# Altium schematic sheet Sheet1chinh_thuc_2.SchDoc
size A4; SheetNumber: 1; SheetTotal: 1
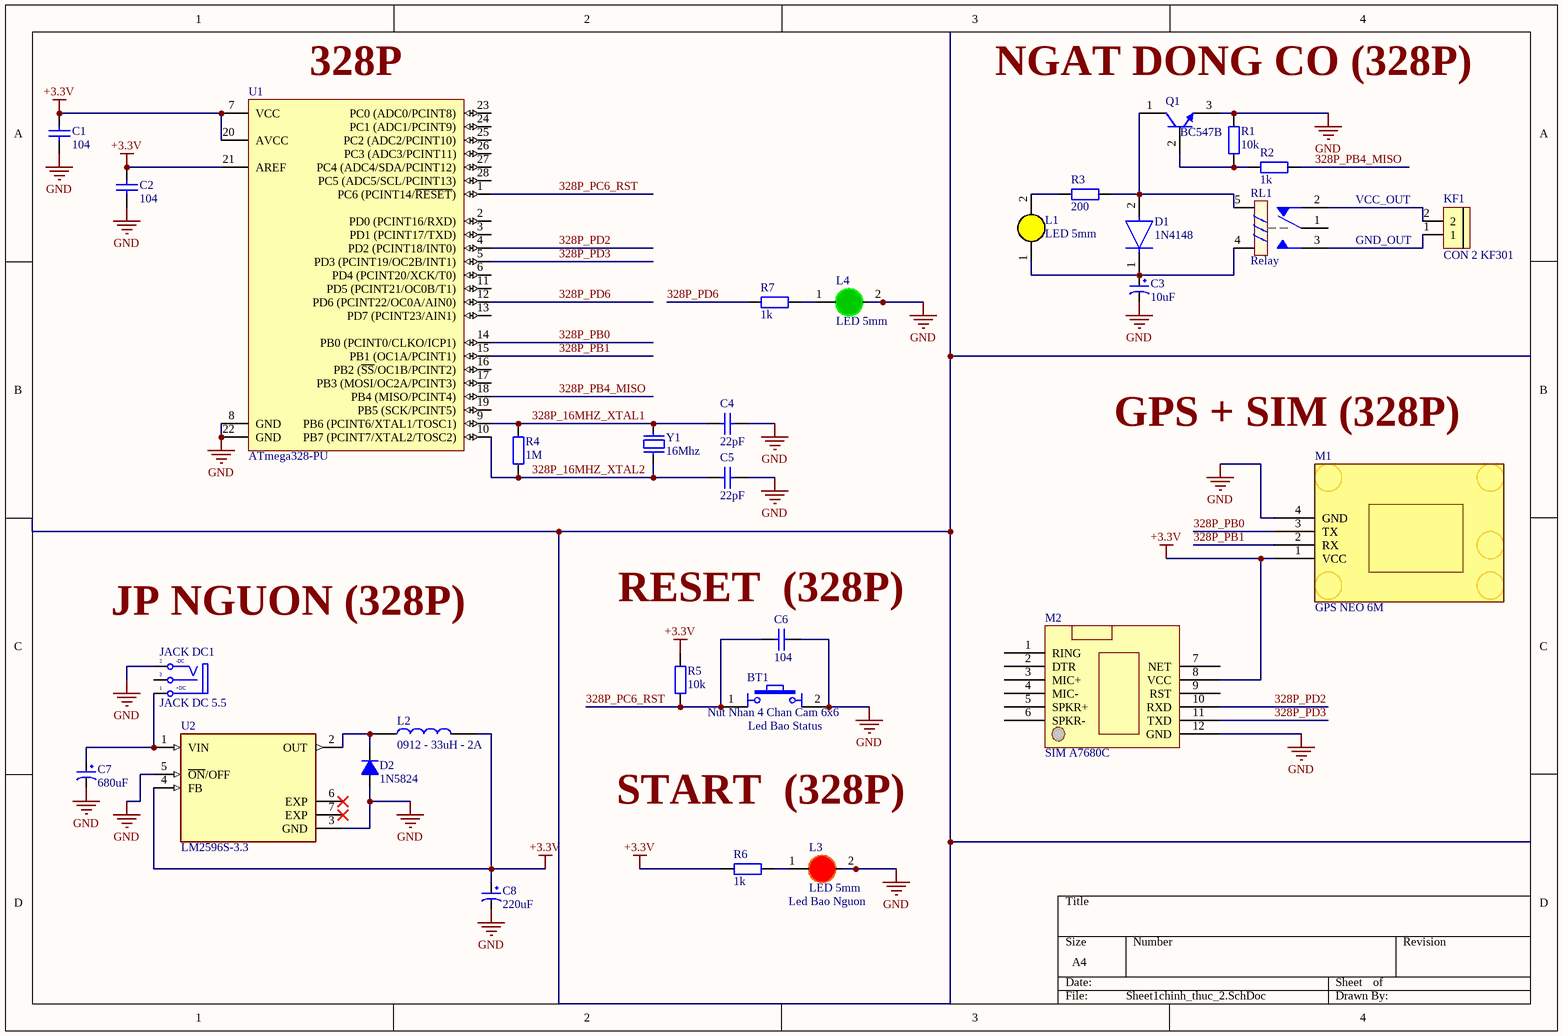
[diagram p0: Sheet1chinh_thuc_2.SchDoc]

## Parts
BT1  Nut Nhan 4 Chan Cam 6x6  [Nut Nhan 4 Chan Cam 6x6]
C1  104  [tu gom]
C2  104  [tu gom]
C3  10uF  [tu hoa 4mm]
C4  22pF  [tu gom]
C5  22pF  [tu gom]
C6  104  [tu gom]
C7  680uF  [tu hoa 13mm]
C8  220uF  [Tu hoa 8mm]
D1  1N4148  [FP-017AG-MFG]
D2  1N5824  [DIODE 0.5A]
JACK_DC1  JACK DC 5.5  [JACK DC 5.5]
KF1  CON 2 KF301  [Con 2 KF301 5.08]
L1  LED 5mm  [LED-5MM-Yellow]
L2  0912 - 33uH - 2A  [CUON CAM 100uH3A]
L3  LED 5mm  [LED-5MM-RED]
L4  LED 5mm  [LED-5MM-Green]
M1  GPS NEO 6M  [PCBComponent_1]
M2  SIM A7680C  [PCBComponent_1]
Q1  BC547B  [ONSC-TO-92-3-29-11]
R1  10k  [tro vach 1/2w]
R2  1k  [tro vach 1/2w]
R3  200  [tro vach 1/2w]
R4  1M  [tro vach 1/2w]
R5  10k  [tro vach 1/2w]
R6  1k  [tro vach 1/2w]
R7  1k  [tro vach 1/2w]
RL1  Relay  [Relay 5 Chan SRD]
U1  ATmega328-PU  [28P3]
U2  LM2596S-3.3  [VREG_LM2596S-3.3]
Y1  16Mhz  [Thach Anh 2 chan cam]

## Nets
+3.3V: C1.1 C2.1 C8.1 L2.2 M1.1(VCC) M2.8(VCC) R5.2 R6.1 U1.7(VCC) U1.20(AVCC) U1.21(AREF) U2.4(FB)
GND: BT1.2 C1.2 C2.2 C3.2 C4.1 C5.1 C6.1 C7.2 C8.2 D2.1(A) JACK_DC1.2(TN) L3.2(K) L4.2(K) M1.4(GND) M2.12(GND) Q1.3(E) R1.2 U1.8(GND) U1.22(GND) U2.3(GND) U2.5(~{ON}/OFF)
328P_16MHZ_XTAL1: C4.2 R4.2 U1.9(PB6_(PCINT6/XTAL1/TOSC1)) Y1.2
328P_16MHZ_XTAL2: C5.2 R4.1 U1.10(PB7_(PCINT7/XTAL2/TOSC2)) Y1.1
328P_PB0: M1.3(TX) U1.14(PB0_(PCINT0/CLKO/ICP1))
328P_PB1: M1.2(RX) U1.15(PB1_(OC1A/PCINT1))
328P_PB4_MISO: R2.2 U1.18(PB4_(MISO/PCINT4))
328P_PC6_RST: BT1.1 C6.2 R5.1 U1.1(PC6_(PCINT14/~{RESET}))
328P_PD2: M2.10(RXD) U1.4(PD2_(PCINT18/INT0))
328P_PD3: M2.11(TXD) U1.5(PD3_(PCINT19/OC2B/INT1))
328P_PD6: R7.1 U1.12(PD6_(PCINT22/OC0A/AIN0))
NetC3_1: C3.1 D1.1(C) L1.1(A) RL1.4
NetC7_1: C7.1 JACK_DC1.1(T) U2.1(VIN)
NetD1_2: D1.2(A) Q1.1(C) R3.2 RL1.5
NetD2_2: D2.2(K) L2.1 U2.2(OUT)
NetKF1_1: KF1.1 RL1.3
NetKF1_2: KF1.2 RL1.2
NetL1_2: L1.2(K) R3.1
NetL3_1: L3.1(A) R6.2
NetL4_1: L4.1(A) R7.2
NetQ1_2: Q1.2(B) R1.1 R2.1

Not connected (* = marked no-connect by the designer): JACK_DC1 3(S); M2 1(RING) 2(DTR) 3(MIC+) 4(MIC-) 5(SPKR+) 6(SPKR-) 7(NET) 9(RST); RL1 1; U1 2(PD0_(PCINT16/RXD)) 3(PD1_(PCINT17/TXD)) 6(PD4_(PCINT20/XCK/T0)) 11(PD5_(PCINT21/OC0B/T1)) 13(PD7_(PCINT23/AIN1)) 16(PB2_(~{SS}/OC1B/PCINT2)) 17(PB3_(MOSI/OC2A/PCINT3)) 19(PB5_(SCK/PCINT5)) 23(PC0_(ADC0/PCINT8)) 24(PC1_(ADC1/PCINT9)) 25(PC2_(ADC2/PCINT10)) 26(PC3_(ADC3/PCINT11)) 27(PC4_(ADC4/SDA/PCINT12)) 28(PC5_(ADC5/SCL/PCINT13)); U2 6(EXP)* 7(EXP)*

## Notes on the sheet
- (near U1) 328P
- NGAT DONG CO (328P)
- VCC_OUT
- GND_OUT
- GPS + SIM (328P)
- (near JACK_DC1) JP NGUON (328P)
- (near C6) RESET  (328P)
- (near BT1) Led Bao Status
- START  (328P)
- Led Bao Nguon
- (in symbol JACK DC 5.5) -DC; +DC

## Library data of the parts
BT1 = Nut Nhan 4 Chan Cam 6x6: Nut Nhan 4 Chan 6x6mm; Ten: Nút Nhấn 4 Chân 6x6x5MM DIP; Ma_Hang: MH004584
C1 C2 C6 = Tu gom 104 50V: Cắm; So_Chan: 2; Ten_Linh_Kien: Tụ gốm 104 100nF 50V; Don_Vi: Con; Ma_Hang: MH004761; Chung_Loai: Cắm; Kieu_Chan: *
C3 = Tu Hoa 10uF 25V 4x7: Cắm; So_Chan: 2; Ten_Linh_Kien: Tụ Hóa 10uF 25V 4x7MM; Don_Vi: Con; Ma_Hang: MH001349; Chung_Loai: Cắm; Kieu_Chan: *
C4 C5 = Tu gom 22pF 50V: Cắm; Don_Vi: Con; So_Chan: 2; Ten_Linh_Kien: Tụ gốm 22P 50V; Ma_Hang: MH004771; Chung_Loai: Cắm; Kieu_Chan: *
C7 = Tu Hoa 680uF 25V 13x17: Cắm; Don_Vi: Con; So_Chan: 2; Ten_Linh_Kien: Tụ Hóa 680uF 25V; Ma_Hang: MH005082; Chung_Loai: Cắm; Kieu_Chan: *
C8 = Tu Hoa 220uF 25V 8x10: Cắm; Don_Vi: Con; So_Chan: 2; Ten_Linh_Kien: Tụ Hóa 220uF 25V 8x10MM; Ma_Hang: MH006864; Chung_Loai: Cắm; Kieu_Chan: *
D1 = CMP-07163-000046-1: DIODE GEN PURP 100V 200MA DO35; Forward Voltage: 1V; Max Power Dissipation: 500mW; Max Reverse Current: 5uA; Forward Current: 300mA; Current: 4A; Reverse Recovery Time: 4ns; Element Configuration: Single; Outside Diameter: 1.85mm; Capacitance: 4pF; Polarity: Standard; Max Forward Surge Current (Ifsm): 1A; Reverse Voltage: 100V; Output Current: 200mA; Average Rectified Current: 200mA; Diameter: 1.91mm; Max Repetitive Reverse Voltage (Vrrm): 100V; Current Rating: 200mA; Case/Package: DO-35; Lead Free: Lead Free; Number of Pins: 2; Recovery Time: 4ns; Packaging: Bulk; Contact Plating: Tin; Voltage: 100V; Mount: Through Hole; Max Surge Current: 4A; Package Quantity: 2000; Width: 1.91mm; Max Reverse Voltage (DC): 100V; Length: 4.56mm; Radiation Hardening: No; Power Dissipation: 500mW; Voltage Rating (DC): 100V; Peak Non-Repetitive Surge Current: 4A; REACH SVHC: No SVHC; Height: 4.56mm; Max Operating Temperature: 175°C; Series: -; Weight: 0.01lb; Min Operating Temperature: -65°C
D2 = Diode 1N4148: Cắm; Ten_Linh_Kien: Diode 1N4148 DO35 450mA 100V ( 1N4148 DIP); Don_Vi: Con; Ma_Hang: MH001065; Ghi Chu: *; Kieu_Chan: *; Chung_Loai: Cắm
JACK_DC1 = JACK DC 5.5: Value: Jac DC
KF1 = CON 2 KF301: Cắm; Ma_Hang: MH000987; Ten_Linh_Kien: CON 2 KF301-2P 5.08MM Xanh Dương; Chung_Loai: Cắm; Ghi_Chu: *; Kieu_Chan: *; Don_Vi: Con
L1 = LED 5mm Vang: Cắm; Don_Vi: Con; Ma_Hang: MH008968; Ten_Linh_Kien: Led 5MM Phủ Vàng (1000c); Ghi_Chu: *; Kieu_Chan: *; Chung_Loai: Cắm
L2 = CUON CAM 470uH DIP: Cắm; Don_Vi: Con; Ma_Hang: MH002232; Ten_Linh_Kien: Cuộn Cảm 470uH 3A 8x10MM; Ghi_Chu: *; Kieu_Chan: *; Chung_Loai: Cắm
L3 = LED 5mm Do: Cắm; Don_Vi: Con; Ma_Hang: MH008967; Ten_Linh_Kien: Led 5MM Phủ Đỏ (1000c); Ghi_Chu: *; Kieu_Chan: *; Chung_Loai: Cắm
L4 = LED 5mm Xanh La: Cắm; Don_Vi: Con; Ma_Hang: MH008969; Ten_Linh_Kien: LED 5MM Phủ Xanh (1000c); Ghi_Chu: *; Kieu_Chan: *; Chung_Loai: Cắm
Q1 = CMP-1048-01467-1: Amplifier Transistor, NPN Silicon, 3-Pin TO-92, Bulk Box; Manufacturer: On Semiconductor; IC Continuous (A): 0.1; fT Min (MHz): 150; DatasheetVersion: Rev. 7; ComponentLink1URL: http://www.onsemi.com/; Polarity: NPN; RoHS: FALSE; ComponentLink1Description: Manufacturer URL; Packing: Bulk Box; PackageDescription: 3-Pin Transistor Outline, Body 4.825 x 3.685 mm, Pitch 1.27 mm; ComponentLink3URL: http://www.onsemi.cn/pub_link/Collateral/2N6426-D.PDF; ComponentLink2Description: Datasheet; PackageVersion: Rev. AM; PackageReference: TO-92-3-29-11_AM_SL; ComponentLink3Description: Package Specification; Mounting Technology: Through Hole; PartNumber: BC547B; ComponentLink2URL: http://www.onsemi.com/pub_link/Collateral/BC546-D.PDF
R1 R5 = Tro Vach 1/2W 5% 10k: Cắm; Don_Vi: Con; So_Chan: 2; Ten_Linh_Kien: Trở 5% 1/2w 10k; Ma_Hang: MH006206; Chung_Loai: Cắm; Kieu_Chan: *
R2 R6 R7 = Tro Vach 1/2W 5% 1k: Cắm; Don_Vi: Con; So_Chan: 2; Ten_Linh_Kien: Trở 5% 1/2w 1K; Ma_Hang: MH007240; Chung_Loai: Cắm; Kieu_Chan: *
R3 = Tro Vach 1/2W 5% 150R: Cắm; Don_Vi: Con; So_Chan: 2; Ten_Linh_Kien: Trở 5% 1/2w 150R; Ma_Hang: MH007244; Chung_Loai: Cắm; Kieu_Chan: *
R4 = Tro Vach 1/2W 5% 1M: Cắm; Don_Vi: Con; So_Chan: 2; Ten_Linh_Kien: Trở 5% 1/2w 1M; Ma_Hang: MH007242; Chung_Loai: Cắm; Kieu_Chan: *
RL1 = Relay 5 Chan SRD: Relay 5 Chan; Ma_Hang: MH009374; Ten: Relay 5V10A SRD-05VDC-SL-C Chính Hãng
U1 = CMP-0095-00015-2: 8-bit AVR Microcontroller, 32KB Flash, 1KB EEPROM, 2KB SRAM, 28-pin PDIP, Industrial Grade (-40°C to 85°C); ComponentLink3Description: ATmega48A/48PA/88A/88PA/168A/168PA/328/328P Summary; RevisionNote: DatasheetVersion updated. URLs added.; DatasheetVersion: revD, May-2011; ComponentLink1URL: http://www.atmel.com/; PackageVersion: revB, Sep-2001; PackageDescription: 28-lead (0.300"/7.62mm Wide) Plastic Dual Inline Package (PDIP); PackageReference: 28P3; ComponentLink1Description: Manufacturer URL; ComponentLink2Description: ATmega48A/48PA/88A/88PA/168A/168PA/328/328P Datasheet; ComponentLink3URL: http://www.atmel.com/dyn/resources/prod_documents/8271S.pdf; ComponentLink2URL: http://www.atmel.com/dyn/resources/prod_documents/8271.pdf
U2 = LM2596S-3.3: SIMPLE SWITCHER&reg; 4.5V to 40V, 3A Low Component Count Step-Down Regulator 5-DDPAK/TO-263; MF: Texas Instruments; Check_prices: https://www.snapeda.com/parts/LM2596S-3.3/Texas+Instruments/view-part/?ref=eda; SnapEDA_Link: https://www.snapeda.com/parts/LM2596S-3.3/Texas+Instruments/view-part/?ref=snap; Availability: In Stock; Value: *; Price: None; MP: LM2596S-3.3; Package: TO-263-5 Texas Instruments; Purchase-URL: https://pricing.snapeda.com/search/part/LM2596S-3.3/?ref=eda
Y1 = Thach Anh 2 chan Cam: Crystal For all Crystal 2pin.; Value: 4Mhz
M1 = GPS NEO 6M: ComponentLink1Description: New link; ComponentLink1URL: *